# EAGLE design Tank CAN Backplane (EAGLE 5.12)
PARTNO: 43045-0615
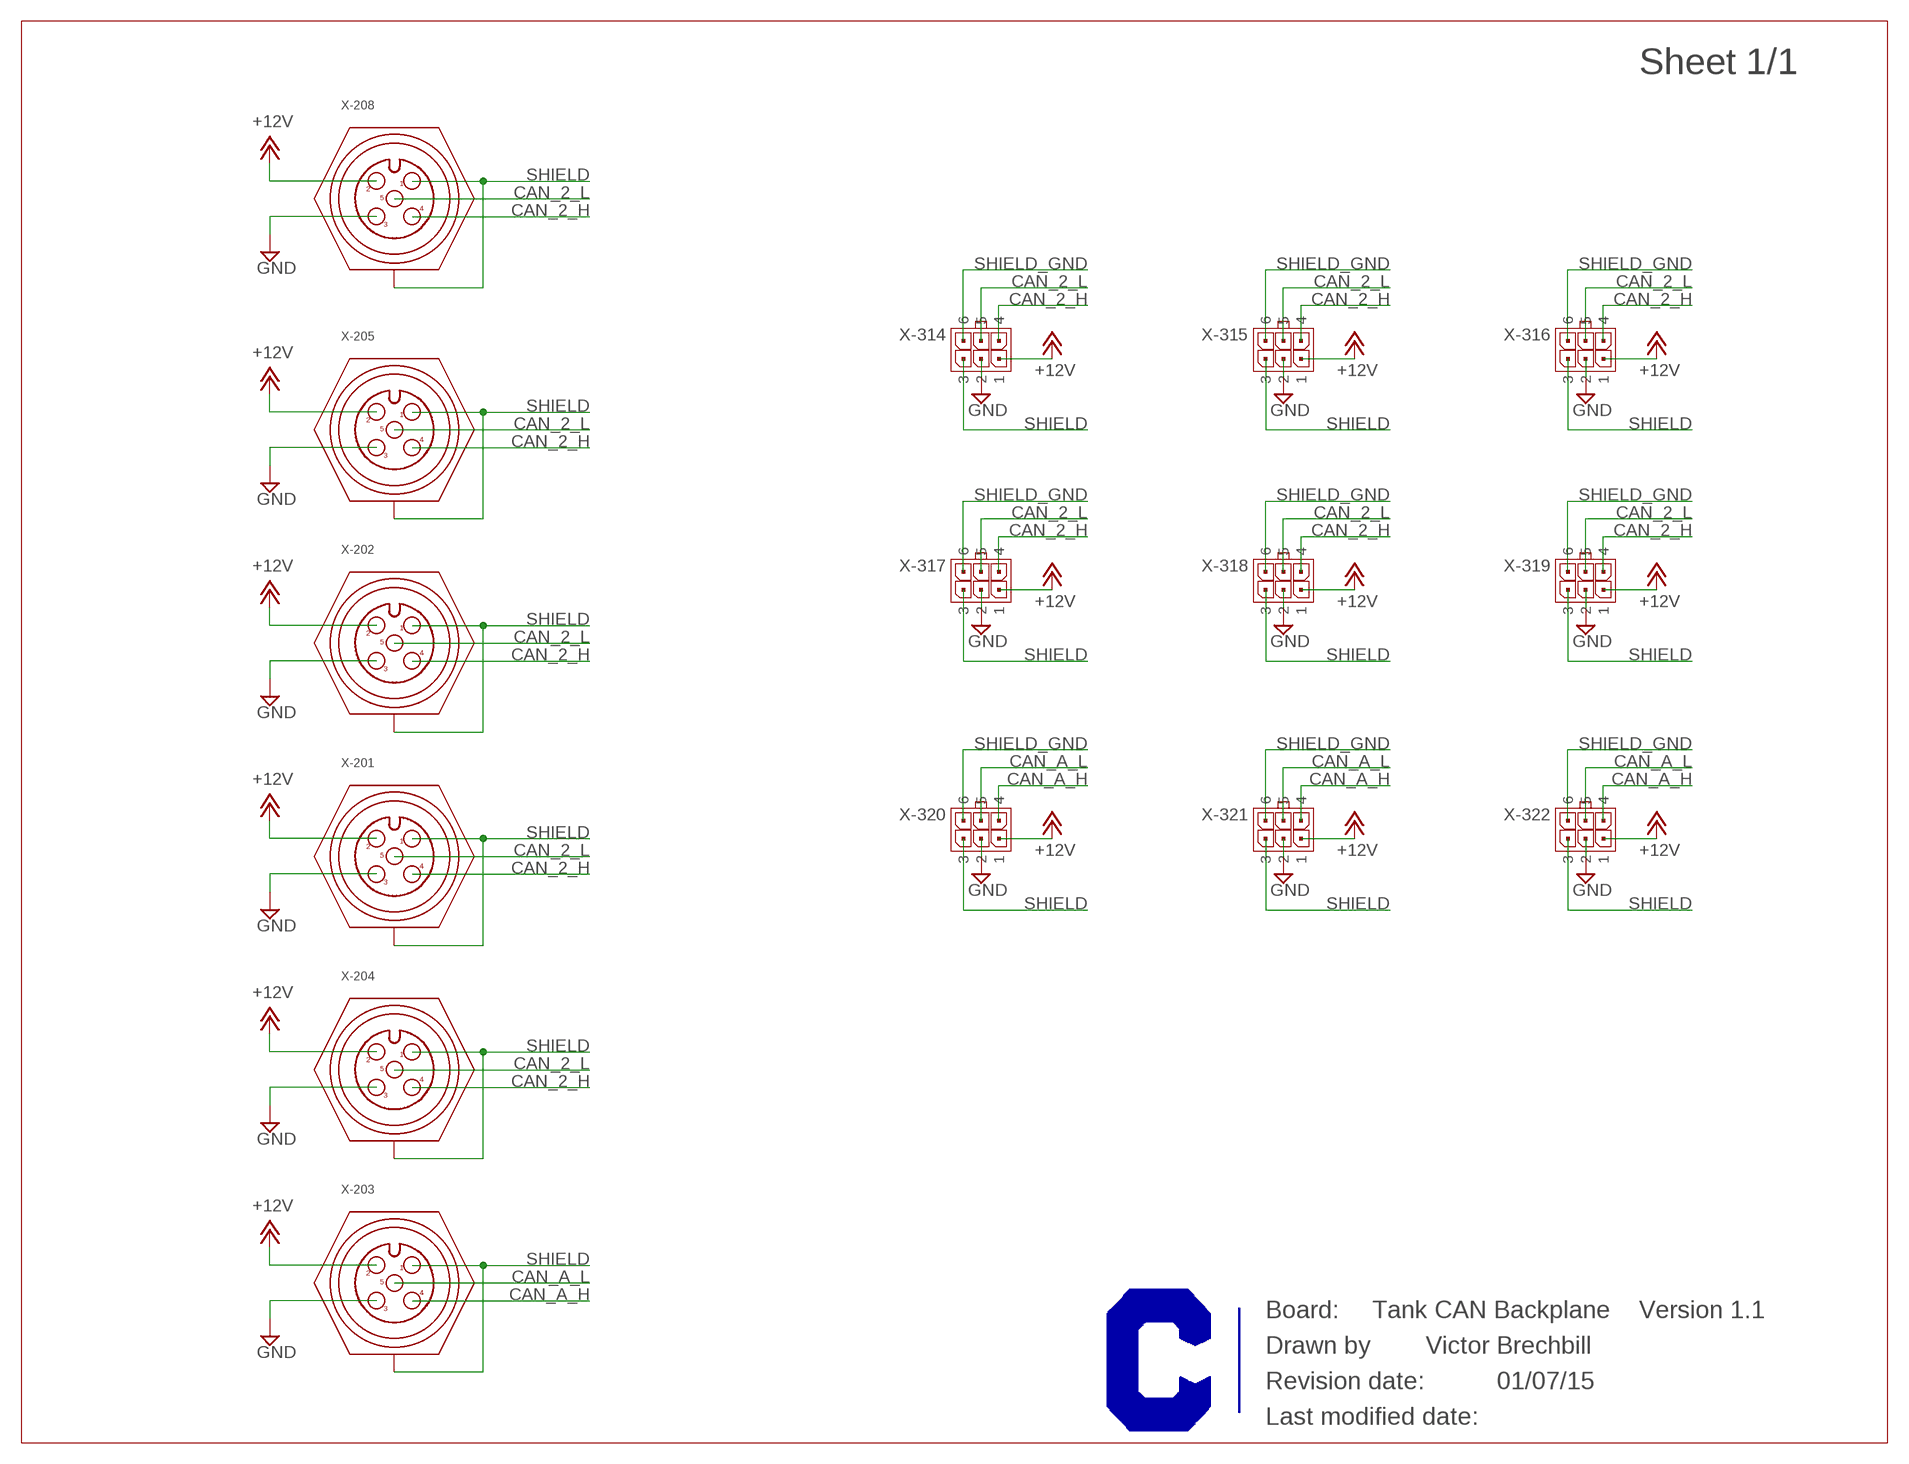
[diagram p0: schematic, sheet 1]

## Parts
U$1  CURRENT-C-LETTER-LANDSCAPE  [BLANK]
X-201  M12-5-VERT-PCB-MALE  [M12-VERT-PCB]
X-202  M12-5-VERT-PCB-MALE  [M12-VERT-PCB]
X-203  M12-5-VERT-PCB-MALE  [M12-VERT-PCB]
X-204  M12-5-VERT-PCB-MALE  [M12-VERT-PCB]
X-205  M12-5-VERT-PCB-MALE  [M12-VERT-PCB]
X-208  M12-5-VERT-PCB-MALE  [M12-VERT-PCB]
X-314  MICROFIT-06-DUAL-VERT-SMD-CLIP_RETENTION  [MICROFIT-6-VERT-SMD-CLIP_RETENTION]
X-315  MICROFIT-06-DUAL-VERT-SMD-CLIP_RETENTION  [MICROFIT-6-VERT-SMD-CLIP_RETENTION]
X-316  MICROFIT-06-DUAL-VERT-SMD-CLIP_RETENTION  [MICROFIT-6-VERT-SMD-CLIP_RETENTION]
X-317  MICROFIT-06-DUAL-VERT-SMD-CLIP_RETENTION  [MICROFIT-6-VERT-SMD-CLIP_RETENTION]
X-318  MICROFIT-06-DUAL-VERT-SMD-CLIP_RETENTION  [MICROFIT-6-VERT-SMD-CLIP_RETENTION]
X-319  MICROFIT-06-DUAL-VERT-SMD-CLIP_RETENTION  [MICROFIT-6-VERT-SMD-CLIP_RETENTION]
X-320  MICROFIT-06-DUAL-VERT-SMD-CLIP_RETENTION  [MICROFIT-6-VERT-SMD-CLIP_RETENTION]
X-321  MICROFIT-06-DUAL-VERT-SMD-CLIP_RETENTION  [MICROFIT-6-VERT-SMD-CLIP_RETENTION]
X-322  MICROFIT-06-DUAL-VERT-SMD-CLIP_RETENTION  [MICROFIT-6-VERT-SMD-CLIP_RETENTION]

## Nets
+12V: X-201.2 X-202.2 X-203.2 X-204.2 X-205.2 X-208.2 X-314.1 X-315.1 X-316.1 X-317.1 X-318.1 X-319.1 X-320.1 X-321.1 X-322.1
CAN_2_H: X-201.4 X-202.4 X-204.4 X-205.4 X-208.4 X-314.4 X-315.4 X-316.4 X-317.4 X-318.4 X-319.4
CAN_2_L: X-201.5 X-202.5 X-204.5 X-205.5 X-208.5 X-314.5 X-315.5 X-316.5 X-317.5 X-318.5 X-319.5
CAN_A_H: X-203.4 X-320.4 X-321.4 X-322.4
CAN_A_L: X-203.5 X-320.5 X-321.5 X-322.5
GND: X-201.3 X-202.3 X-203.3 X-204.3 X-205.3 X-208.3 X-314.2 X-314.6 X-315.2 X-315.6 X-316.2 X-316.6 X-317.2 X-317.6 X-318.2 X-318.6 X-319.2 X-319.6 X-320.2 X-320.6 X-321.2 X-321.6 X-322.2 X-322.6
SHIELD: X-201.1 X-201.SHIELD X-202.1 X-202.SHIELD X-203.1 X-203.SHIELD X-204.1 X-204.SHIELD X-205.1 X-205.SHIELD X-208.1 X-208.SHIELD X-314.3 X-315.3 X-316.3 X-317.3 X-318.3 X-319.3 X-320.3 X-321.3 X-322.3

## Notes on the sheet
- SHIELD_GND | SHIELD_GND | SHIELD_GND
- SHIELD_GND | SHIELD_GND | SHIELD_GND
- SHIELD_GND | SHIELD_GND | SHIELD_GND
- Tank CAN Backplane | Version 1.1
- Victor Brechbill
- 01/07/15

## Library data of the parts
U$1 = Frames:CURRENT-C-LETTER-LANDSCAPE; BOM: EXCLUDE
X-201-X-205 X-208 = Conec:M12-5: http://media.digikey.com/pdf/Data%20Sheets/Conec%20PDFs/43-01208-11_Dwg.pdf; PARTNO: 43-01169
X-314-X-322 = Molex:MICROFIT-06-DUAL: Molex MicroFit 3.00mm Pitch Header, Surface Mount, Dual Row, 6 Circuits Note, November 2014: These come in three styles: Through-hole, with metal clip retention to PCB (not currently represented) (cheapest) SMD, with solder tab retention (-SMD) (more expensive, commonly stocked) SMD, with metal clip retention (-SMD-CLIP_RETENTION) (most expensive, not often stocked) Please use them in that order! Drawing: http://www.molex.com/pdm_docs/sd/430450609_sd.pdf (right-angle) Information: http://www.molex.com/molex/products/datasheet.jsp?part=active/0430450618_PCB_HEADERS.xml

## Board
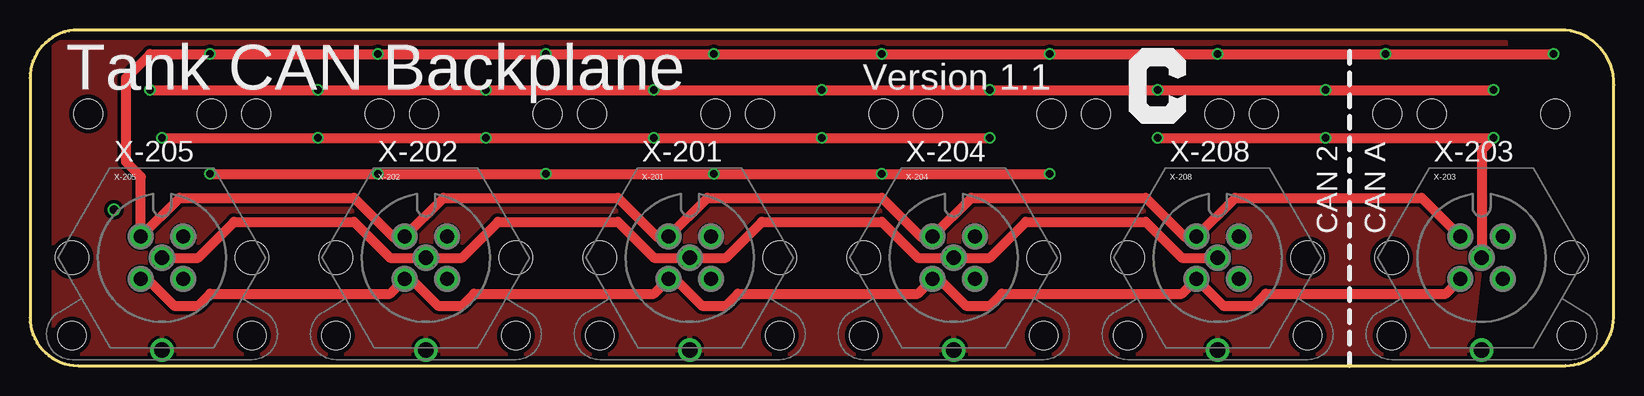
[diagram p1: board, top side]
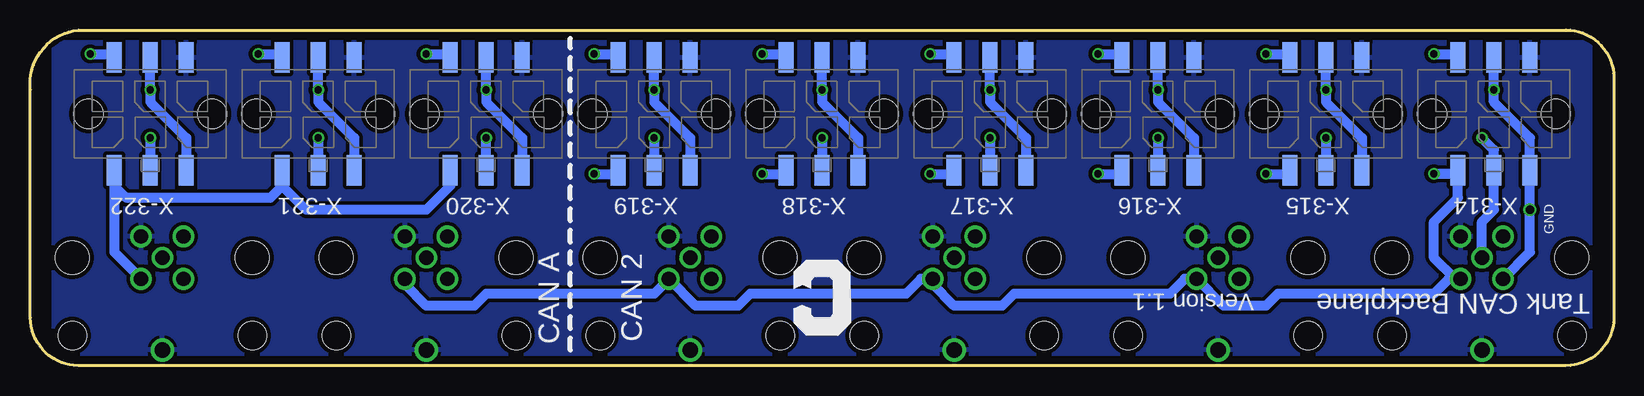
[diagram p2: board, bottom side, seen from below]

Size 132.03 x 28 mm. Coordinates in mm from the lower left corner, seen from the top.
Outline: 128,0 arc90 132,4 132,23 arc90 128,28 4,28 arc90 0,24 0,4 arc90 4,0 128,0
Copper layers (1*16): Top 0.0356mm / dielectric 1.5011mm / Bottom 0.0356mm
Design rules "OSH Park 2-layer": minimum track width 6mil, minimum drill 13mil, track to track 6mil, track to pad 6mil, pad to pad 6mil, via to via 6mil, smd to smd 6mil, copper to edge 15mil, drill to drill 6mil, minimum pad ring 7mil, minimum via ring 7mil, stop-mask expansion 4mil, vias tented up to drill 0mil, thermal gap 10mil

### Footprints (pad centres in the part's own frame; a part is rotated, then mirrored left to right if it is on the bottom)
M12-VERT-PCB = drill 1.2 round: 1 1.768,1.768; 2 -1.768,1.768; 3 -1.768,-1.768; 4 1.768,-1.768; 5 0,0 | drill 1.3 round: SHIELD 0,-7.7 | hole 2.8: 7.5,0; -7.5,0 | hole 2.35: 7.5,-6.5; -7.5,-6.5
MICROFIT-6-VERT-SMD-CLIP_RETENTION = smd 1.27 x 2.54: 1 3,-4.699; 2 0,-4.699; 3 -3,-4.699; 4 3,4.699; 5 0,4.699; 6 -3,4.699 | hole 2.41: 5.15,0; -5.15,0

### Placement (x,y rotation side)
U$1  -64.77,68.58 0 top  (outside the outline)
X-201  55,9 0 top
X-202  33,9 0 top
X-203  121,9 0 top
X-204  77,9 0 top
X-205  11,9 0 top
X-208  99,9 0 top
X-314  10,21 180 bottom
X-315  24,21 180 bottom
X-316  80,21 180 bottom
X-317  52,21 180 bottom
X-318  66,21 180 bottom
X-319  38,21 180 bottom
X-320  94,21 180 bottom
X-321  108,21 180 bottom
X-322  122,21 180 bottom

### Tracks (layer width: path | path; a pad name or v marks a point on that pad's centre or on a via)
+12V  (via drill 0.6)
  Top 0.813: X-203.2 116,14 100.46,14 X-208.2 96.23,10.77 93,14 78.46,14 X-204.2 74.23,10.77 71,14 56.46,14 X-201.2 52.23,10.77 49,14 34.46,14 X-202.2 30.23,10.77 27,14 12.46,14 X-205.2 9.23,15.77 8,17 8,24 10,26 v15,26 v29,26 v43,26 v57,26 v71,26 v85,26 v99,26 v113,26 v127,26
  Bottom 0.813: X-314.1 13.3,26 v15,26 | X-315.1 27.3,26 v29,26 | X-319.1 41.3,26 v43,26 | X-317.1 55.3,26 v57,26 | X-318.1 69.3,26 v71,26 | X-316.1 83.3,26 v85,26 | X-320.1 97.3,26 v99,26 | X-321.1 111.3,26 v113,26 | X-322.1 125.3,26 v127,26
CAN_2_H  (via drill 0.6)
  Top 0.813: v85,16 v71,16 v57,16 v43,16 v29,16 v15,16
  Bottom 0.813: X-316.4 83.3,16 v85,16 | X-318.4 69.3,16 v71,16 | X-317.4 55.3,16 v57,16 | X-319.4 41.3,16 v43,16 | X-315.4 27.3,16 v29,16 | v15,16 13.3,16 X-314.4 13,14 15,12 15,9 13.23,7.23 X-205.4 13.77,7.23 15,6 28,6 29,5 32.54,5 X-202.4 35.77,7.23 37,6 50,6 51,5 55,5 56.77,6.77 X-201.4 57.77,7.23 59,6 72,6 73,5 76.54,5 X-204.4 80,6 94,6 95,5 99,5 100.77,6.77 X-208.4
CAN_2_L  (via drill 0.6)
  Top 0.813: X-205.5 14,9 17,12 27,12 30,9 X-202.5 36,9 39,12 49,12 52,9 X-201.5 58,9 61,12 71,12 74,9 X-204.5 80,9 83,12 93,12 96,9 X-208.5 | v11,19 v24,19 v38,19 v52,19 v66,19 v80,19
  Bottom 0.813: X-205.5 11,12 10,13 X-314.5 10,18 v11,19 | v24,19 X-315.5 | v80,19 X-316.5 | v66,19 X-318.5 | v52,19 X-317.5 | v38,19 X-319.5
CAN_A_H
  Bottom 0.813: X-203.4 125,9.46 125,15 | 125,15 X-322.4 | X-320.4 97,15 99,13 109,13 111,15 | 111,15 X-321.4 | 111,15 112,14 124,14 125,15
CAN_A_L  (via drill 0.6)
  Top 0.813: X-203.5 121,18 v122,19 v108,19 v94,19
  Bottom 0.813: v122,19 X-322.5 | X-320.5 v94,19 | v108,19 X-321.5
GND  (via drill 0.6, 0.7)
  Top 0.813: X-205.3 9.77,7.23 12,5 14,5 15,6 30,6 X-202.3 31.77,7.23 34,5 36,5 37,6 52,6 X-201.3 53.77,7.23 56,5 58,5 59,6 74,6 X-204.3 75.77,7.23 78,5 80,5 81,6 96,6 X-208.3 99.46,5 102,5 103,6 118,6 X-203.3 | v10,23 v24,23 v38,23 v52,23 v66,23 v80,23 v94,23 v108,23 v122,23
  Bottom 0.813: X-315.2 v24,23 24,22 21,19 X-315.6 | X-319.2 v38,23 38,22 35,19 X-319.6 | X-317.2 v52,23 52,22 49,19 X-317.6 | X-314.2 v10,23 10,22 7,19 X-314.6 v7,13 7,9.46 X-205.3 | X-318.2 v66,23 66,22 63,19 X-318.6 | X-316.2 v80,23 80,22 77,19 X-316.6 | X-320.2 v94,23 94,22 91,19 X-320.6 | X-321.2 v108,23 108,22 105,19 X-321.6 | X-322.2 v122,23 122,22 119,19 X-322.6
SHIELD
  pour Bottom (isolate 0.305): 2,27 2,1 130,1 130,27
  pour Top (isolate 0.305): 2,27 123,27 120,1 2,1

### Text on the board
_tsilk: Tank CAN Backplane | Version 1.1 | X-205 | X-202 | X-201 | X-204 | X-208 | X-203 | CAN 2 | CAN A
_bsilk: X-314 | X-315 | X-316 | X-317 | X-318 | X-319 | X-320 | X-321 | X-322 | GND | Tank CAN Backplane | Version 1.1 | CAN 2 | CAN A